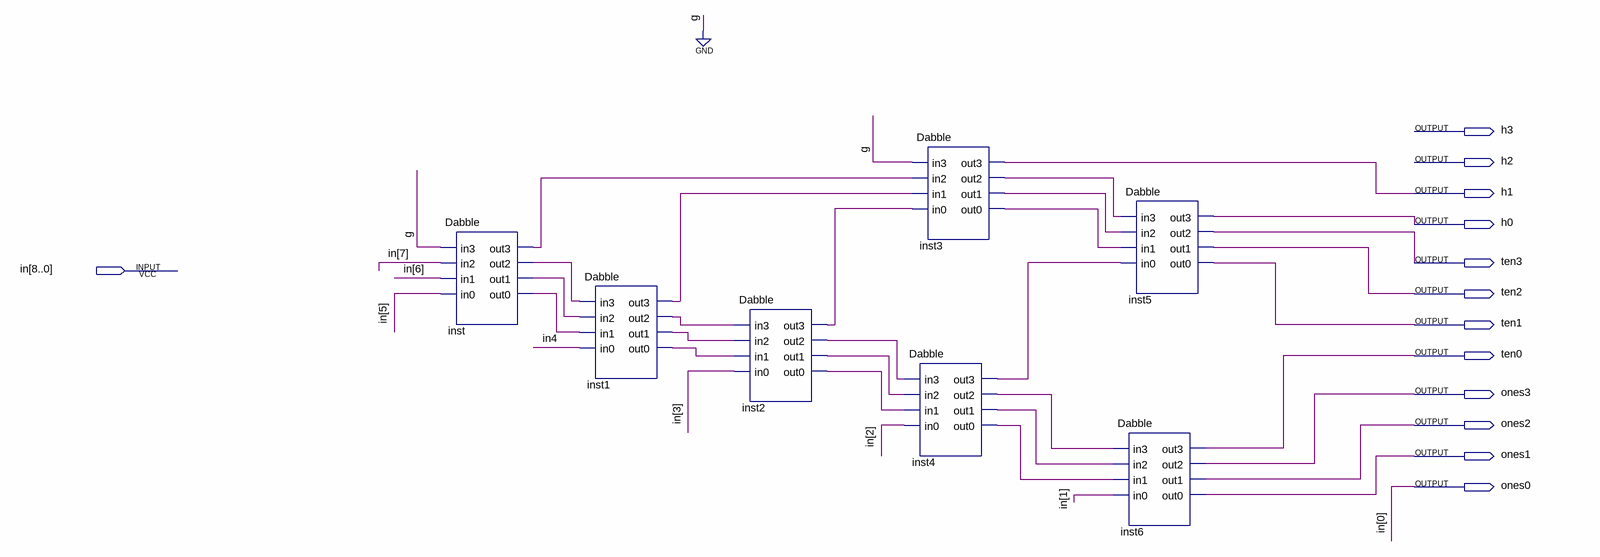
[diagram p0: schematic sheet]
// Quartus schematic dbDable.bdf as structural Verilog: 7 symbols, 13 pins
module dbDable (
  input  [8:0] in,
  output h3,
  output h2,
  output h1,
  output h0,
  output ten3,
  output ten2,
  output ten1,
  output ten0,
  output ones3,
  output ones2,
  output ones1,
  output ones0
);

  wire inst1_out0, inst1_out1, inst1_out2, inst1_out3, inst2_out0, inst2_out1, inst2_out2, inst2_out3,
       inst3_out0, inst3_out1, inst3_out2, inst4_out0, inst4_out1, inst4_out2, inst4_out3, inst_out0,
       inst_out1, inst_out2, inst_out3;

  Dabble inst (
    .in3(1'b0), .in2(in[7]), .in1(in[6]), .in0(in[5]), .out3(inst_out3), .out2(inst_out2), .out1(inst_out1),
    .out0(inst_out0));
  Dabble inst1 (
    .in3(inst_out2), .in2(inst_out1), .in1(inst_out0), .in0(in[4]), .out3(inst1_out3), .out2(inst1_out2),
    .out1(inst1_out1), .out0(inst1_out0));
  Dabble inst2 (
    .in3(inst1_out2), .in2(inst1_out1), .in1(inst1_out0), .in0(in[3]), .out3(inst2_out3), .out2(inst2_out2),
    .out1(inst2_out1), .out0(inst2_out0));
  Dabble inst3 (
    .in3(1'b0), .in2(inst_out3), .in1(inst1_out3), .in0(inst2_out3), .out3(h1), .out2(inst3_out2),
    .out1(inst3_out1), .out0(inst3_out0));
  Dabble inst4 (
    .in3(inst2_out2), .in2(inst2_out1), .in1(inst2_out0), .in0(in[2]), .out3(inst4_out3), .out2(inst4_out2),
    .out1(inst4_out1), .out0(inst4_out0));
  Dabble inst5 (
    .in3(inst3_out2), .in2(inst3_out1), .in1(inst3_out0), .in0(inst4_out3), .out3(h0), .out2(ten3),
    .out1(ten2), .out0(ten1));
  Dabble inst6 (
    .in3(inst4_out2), .in2(inst4_out1), .in1(inst4_out0), .in0(in[1]), .out3(ten0), .out2(ones3),
    .out1(ones2), .out0(ones1));

  assign ones0 = in[0];
endmodule
